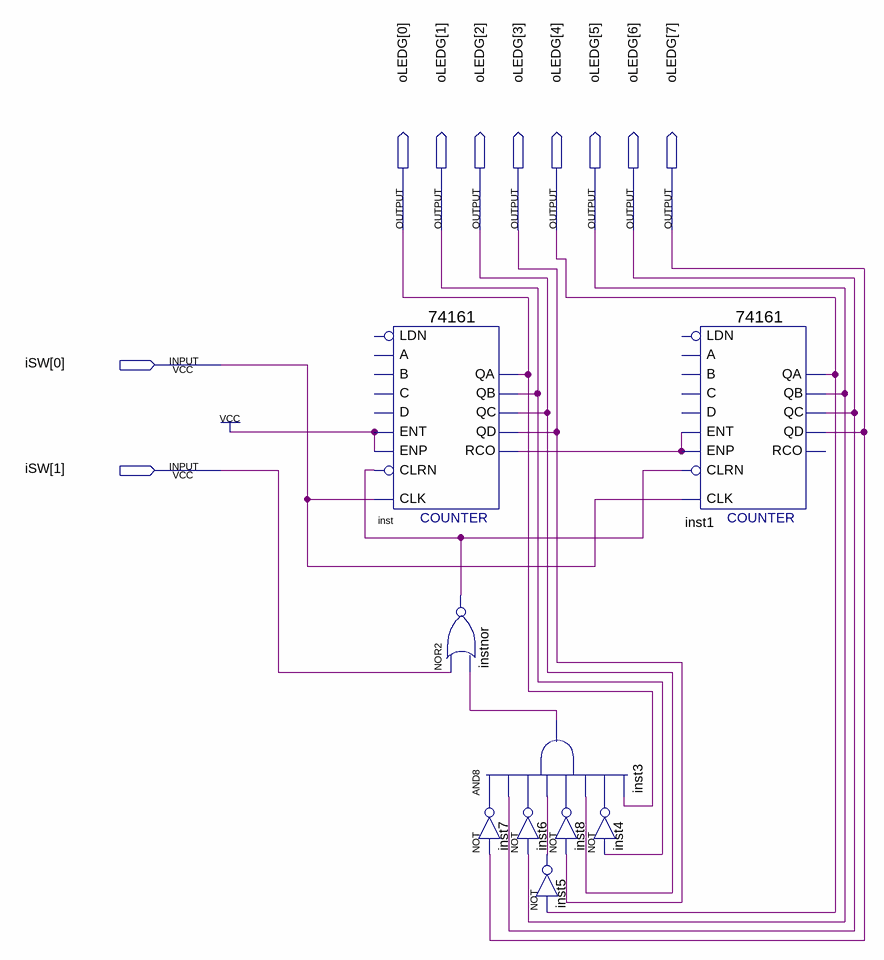
[diagram p0: schematic sheet]
// Quartus schematic Cwiczenie3_2.bdf as structural Verilog: 9 symbols, 10 pins
module Cwiczenie3_2 (
  input  [1:0] iSW,
  output [7:0] oLEDG
);

  wire inst3_out, inst4_out, inst5_out, inst6_out, inst7_out, inst8_out, inst_rco, instnor_out;

  \74161  inst (
    .CLRN(instnor_out), .CLK(iSW[0]), .ENP(1'b1), .ENT(1'b1), .QD(oLEDG[3]), .QC(oLEDG[2]), .QB(oLEDG[1]),
    .QA(oLEDG[0]), .RCO(inst_rco));  // open: LDN, A, D, B, C
  nor instnor (instnor_out, iSW[1], inst3_out);
  and inst3 (inst3_out, inst7_out, oLEDG[6], inst6_out, inst5_out, inst8_out, oLEDG[2], inst4_out, oLEDG[0]);
  not inst6 (inst6_out, oLEDG[5]);
  not inst7 (inst7_out, oLEDG[7]);
  not inst4 (inst4_out, oLEDG[1]);
  not inst8 (inst8_out, oLEDG[3]);
  not inst5 (inst5_out, oLEDG[4]);
  \74161  inst1 (
    .CLRN(instnor_out), .CLK(iSW[0]), .ENP(inst_rco), .ENT(inst_rco), .QD(oLEDG[7]), .QC(oLEDG[6]),
    .QB(oLEDG[5]), .QA(oLEDG[4]));  // open: LDN, A, D, B, C, RCO
endmodule
